# EAGLE design IR_Detector (EAGLE 7.4.0)
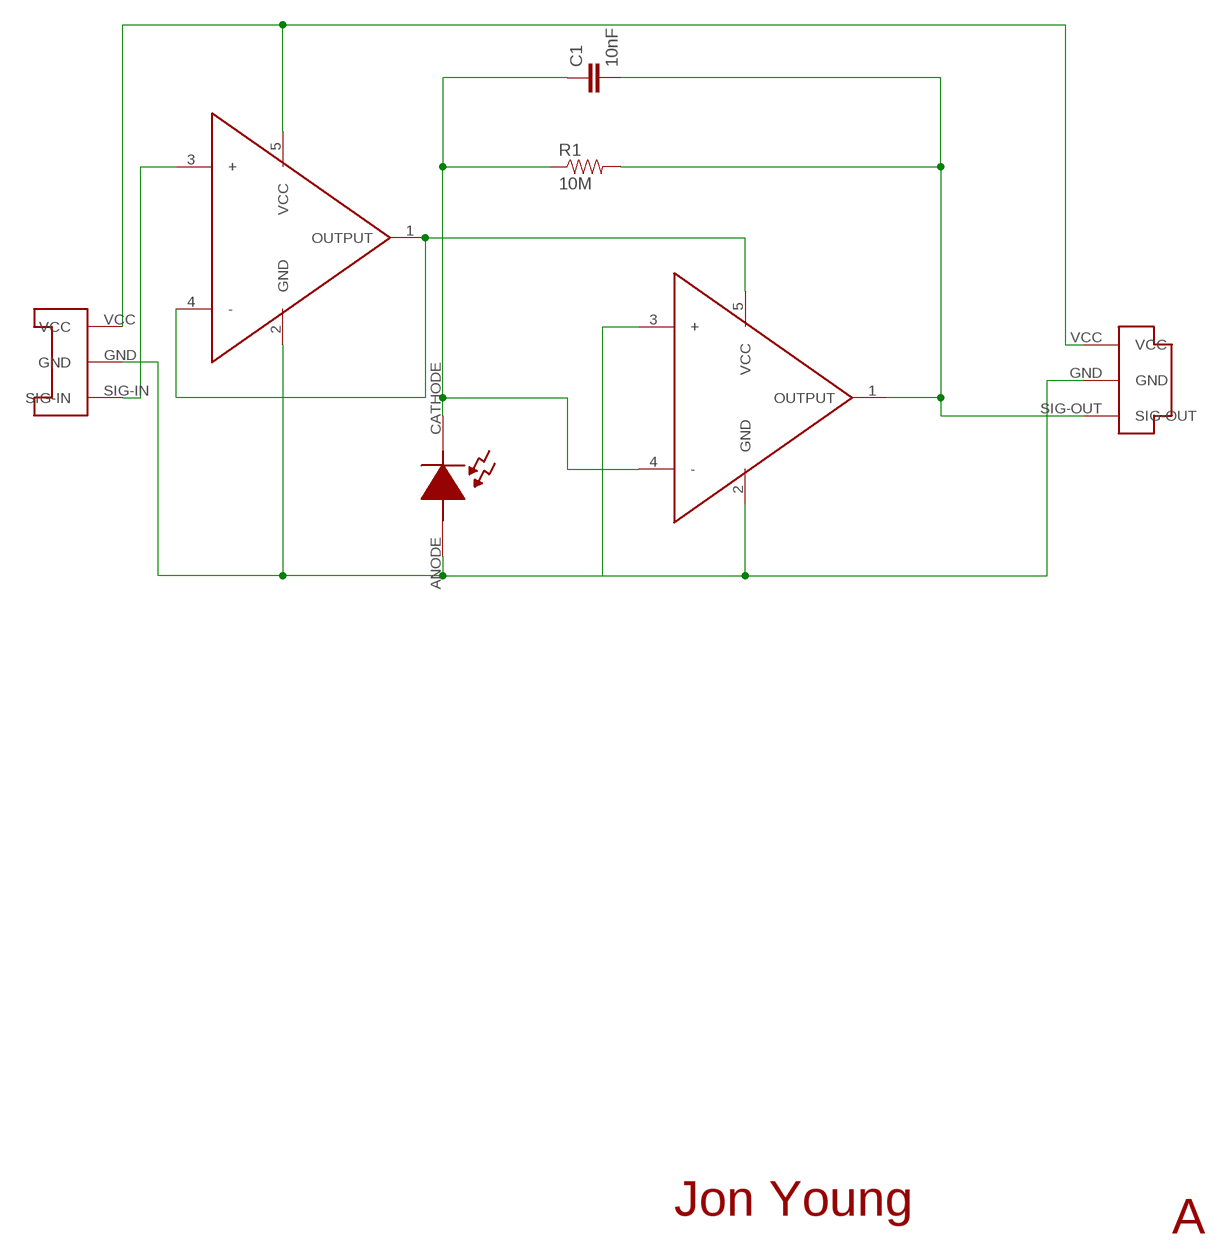
[diagram p0: schematic, sheet 1]

## Parts
C1  10nF  CAP0603-CAP  [0603-CAP]
R1  10M  RESISTOR0603  [0603-RES]
U$1  CONN-PLUG-3POS-3MM  [PLUG-3POS-3MM-SMD]
U$2  CONN-SOCKET-3POS-3MM  [SOCKET-3POS-3MM-SMD]
U$3  VEMD2020  [VEMD2020X01]
U$4  OPAMP-MCP6001SC70-5  [SC70]
U$5  OPAMP-MCP6001SC70-5  [SC70]

## Nets
GND: U$1.GND U$2.GND U$3.ANODE U$4.2(GND) U$4.3(+) U$5.2(GND)
N$5: U$2.SIG-IN U$5.3(+)
N$6: C1.1 R1.1 U$3.CATHODE U$4.4(-)
N$7: U$4.5(VCC) U$5.1(OUTPUT) U$5.4(-)
SIG-OUT: C1.2 R1.2 U$1.SIG-OUT U$4.1(OUTPUT)
VCC: U$1.VCC U$2.VCC U$5.5(VCC)

## Notes on the sheet
- Jon Young
- A

## Library data of the parts
C1 = SparkFun-Capacitors:CAP: Capacitor Standard 0603 ceramic capacitor, and 0.1" leaded capacitor.
R1 = SparkFun-Resistors:RESISTOR: Resistor Basic schematic elements and footprints for 0603, 1206, and PTH resistors.
U$1 = EmbeddedPlayground:CONN-PLUG-3POS-3MM: Surface mount board to board connector. Female socket, 3 position.
U$2 = EmbeddedPlayground:CONN-SOCKET-3POS-3MM: Surface mount board to board connector. Female socket, 3 position.
U$3 = EmbeddedPlayground:VEMD2020
U$4 U$5 = EmbeddedPlayground:OPAMP-MCP6001

## Board
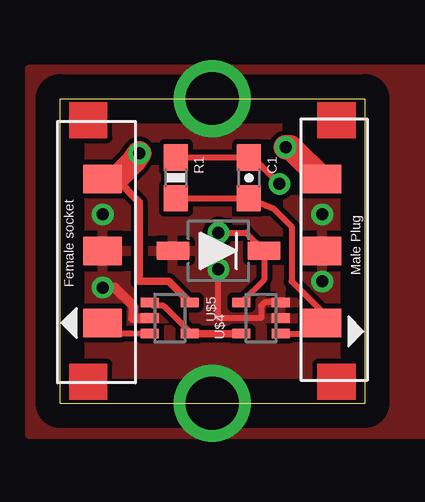
[diagram p1: board, top side]
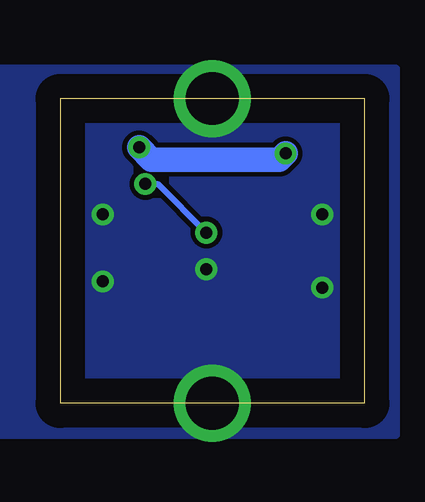
[diagram p2: board, bottom side, seen from below]

Size 12.7 x 12.7 mm. Coordinates in mm from the lower left corner, seen from the top.
Outline: 0,0 12.7,0 12.7,12.7 0,12.7 0,0
Copper layers (1*16): Top 0.035mm / dielectric 1.5mm / Bottom 0.035mm
Design rules "default": minimum track width 10mil, minimum drill 24mil, track to track 8mil, track to pad 8mil, pad to pad 8mil, via to via 8mil, smd to smd 8mil, copper to edge 40mil, drill to drill 8mil, minimum pad ring 10mil, minimum via ring 8mil, stop-mask expansion 4mil, vias tented up to drill 0mil, thermal gap 10mil

### Footprints (pad centres in the part's own frame; a part is rotated, then mirrored left to right if it is on the bottom)
0603-CAP = smd 1.1 x 1: 1 -0.85,0; 2 0.85,0
0603-RES = smd 1.1 x 1: 1 -0.85,0; 2 0.85,0
PLUG-3POS-3MM-SMD = smd 1.2 x 1.6: GND 0,0; SIG-OUT 3,0; VCC -3,0
SOCKET-3POS-3MM-SMD = smd 1.2 x 1.6: GND 0,0; SIG-IN -3,0; VCC 3,0
VEMD2020X01 = smd 1.35 x 0.75: ANODE 1.9,0; CATHODE -1.9,0
SC70 = smd 0.4 x 0.75: 1 -0.65,-0.825; 2 0,-0.825; 3 0.65,-0.825; 4 0.65,0.825; 5 -0.65,0.825

### Placement (x,y rotation side)
C1  7.87,9.4 270 top
R1  4.83,9.4 270 top
U$1  10.92,6.35 270 top
U$2  1.78,6.35 90 top
U$3  6.6,6.35 180 top
U$4  8.38,3.56 90 top
U$5  4.57,3.56 270 top

### Tracks (layer width: path | path; a pad name or v marks a point on that pad's centre or on a via)
GND  (via drill 0.5, 2.2)
  Top 0.254: U$4.3 8.52,4.21 8.38,4.06 8.38,3.56 6.6,3.56 v6.6,5.59
  Top 0.406: v1.78,4.83 2.29,4.83 3.05,4.06 3.05,3.56 U$5.2
  other vias: 10.92,7.87 10.92,5.08 1.78,7.87 6.35,0 6.35,12.7
  pour Top: -1.27,13.91 -1.27,-1.27 16.42,-1.27 16.42,13.91
  pour Bottom: -1.27,13.91 16.42,13.91 16.42,-1.27 -1.27,-1.27
N$5
  Top 0.254: U$5.3 2.22,2.91 U$2.SIG-IN
N$6  (via drill 0.5)
  Top 0.254: R1.1 C1.1 8.04,10.25 v9.14,9.14 | v6.6,7.11 7.74,7.11 U$3.CATHODE 8.5,5.15 U$4.4
  Bottom 0.254: v9.14,9.14 8.64,9.14 v6.6,7.11
N$7
  Top 0.254: U$5.4 5.4,2.98 4.32,4.06 3.89,4.06 U$5.1
  Top 0.305: U$5.4 U$4.5
N$8  (via drill 0.5)
  other vias: 9.14,9.14
N$9  (via drill 0.5)
  other vias: 6.6,7.11
SIG-OUT
  Top 0.254: R1.2 C1.2 8.89,8.13 9.65,7.37 9.65,5.08 10.92,3.81 U$1.SIG-OUT 10.48,2.91 U$4.1
VCC  (via drill 0.5)
  Top 0.305: U$2.VCC 2.33,9.35 3.3,8.38 3.3,5.08 4.52,5.08 U$5.5
  Top 1.016: v3.3,10.41 3.05,10.06 2.33,9.35 | v9.4,10.67 9.6,10.67 U$1.VCC
  Bottom 1.016: v3.3,10.41 3.56,10.16 8.89,10.16 v9.4,10.67